# Altium schematic sheet NIXIE_4.SchDoc
size A4; SheetNumber: 7; SheetTotal: 6
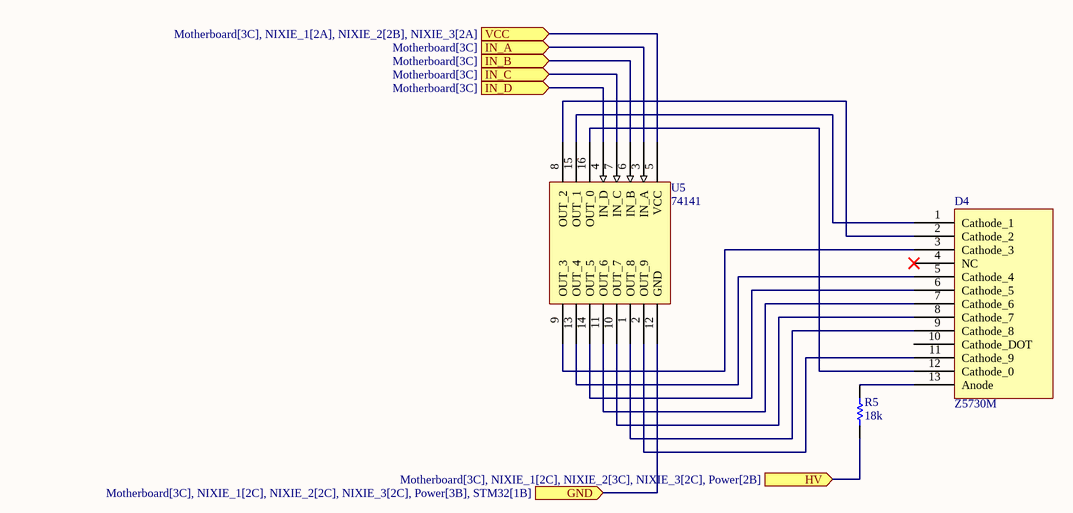
[diagram p0: NIXIE_4.SchDoc]

## Parts
D4  Z5730M  [Z5730M]
R5  18k  [RESC2013X60X40LL20T25]
U5  74141  [DIP-16]

## Ports
GND (in, see Motherboard[3C], NIXIE_1[2C], NIXIE_2[2C], NIXIE_3[2C], Power[3B], STM32[1B]), HV (in, see Motherboard[3C], NIXIE_1[2C], NIXIE_2[3C], NIXIE_3[2C], Power[2B]), IN_A (in, see Motherboard[3C]), IN_B (in, see Motherboard[3C]), IN_C (in, see Motherboard[3C]), IN_D (in, see Motherboard[3C]), VCC (in, see Motherboard[3C], NIXIE_1[2A], NIXIE_2[2B], NIXIE_3[2A])

## Nets
GND: U5.12(GND) ; port GND
HV: R5.1 ; port HV
IN_A: U5.3(IN_A) ; port IN_A
IN_B: U5.6(IN_B) ; port IN_B
IN_C: U5.7(IN_C) ; port IN_C
IN_D: U5.4(IN_D) ; port IN_D
VCC: U5.5(VCC) ; port VCC
NetD4_1: D4.1(Cathode_1) U5.15(OUT_1)
NetD4_2: D4.2(Cathode_2) U5.8(OUT_2)
NetD4_3: D4.3(Cathode_3) U5.9(OUT_3)
NetD4_5: D4.5(Cathode_4) U5.13(OUT_4)
NetD4_6: D4.6(Cathode_5) U5.14(OUT_5)
NetD4_7: D4.7(Cathode_6) U5.11(OUT_6)
NetD4_8: D4.8(Cathode_7) U5.10(OUT_7)
NetD4_9: D4.9(Cathode_8) U5.1(OUT_8)
NetD4_11: D4.11(Cathode_9) U5.2(OUT_9)
NetD4_12: D4.12(Cathode_0) U5.16(OUT_0)
NetD4_13: D4.13(Anode) R5.2

Not connected (* = marked no-connect by the designer): D4 4(NC)* 10(Cathode_DOT)

## Library data of the parts
R5 = CMP-2001-00606-1: Manufacturer: Panasonic; Part Number: ERA6AEB183V